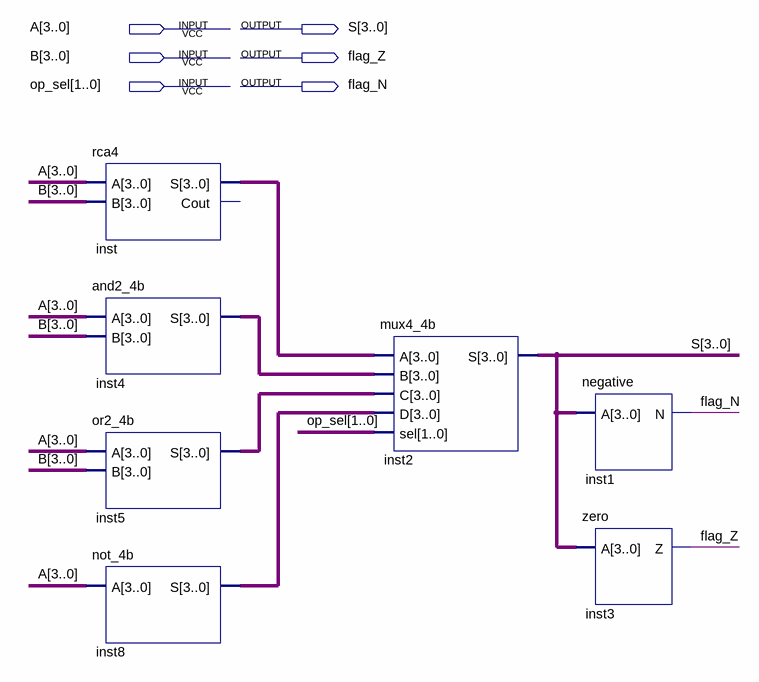
[diagram p0: schematic sheet]
// Quartus schematic ula.bdf as structural Verilog: 7 symbols, 6 pins
module ula (
  input  [3:0] A,
  input  [3:0] B,
  input  [1:0] op_sel,
  output [3:0] S,
  output flag_Z,
  output flag_N
);

  wire [3:0] inst4_s, inst5_s, inst8_s, inst_s;

  rca4 inst (.A(A), .B(B), .S(inst_s));  // open: Cout
  and2_4b inst4 (.A(A), .B(B), .S(inst4_s));
  or2_4b inst5 (.A(A), .B(B), .S(inst5_s));
  not_4b inst8 (.A(A), .S(inst8_s));
  mux4_4b inst2 (.A(inst_s), .B(inst4_s), .C(inst5_s), .D(inst8_s), .sel(op_sel), .S(S));
  negative inst1 (.A(S), .N(flag_N));
  zero inst3 (.A(S), .Z(flag_Z));
endmodule
